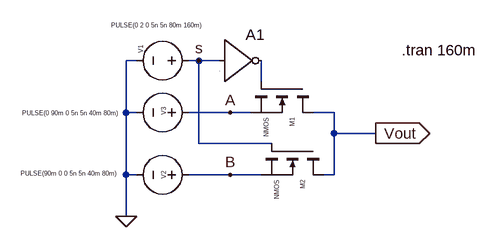
[diagram p0: schematic mux using pass transistors.asc]
mux using pass transistors.asc, the LTspice schematic file:
Version 4
SHEET 1 880 680
WIRE -48 64 -64 64
WIRE 48 64 32 64
WIRE 80 64 48 64
WIRE 144 96 144 64
WIRE -64 144 -64 64
WIRE -48 144 -64 144
WIRE 96 144 32 144
WIRE 128 144 96 144
WIRE 256 144 224 144
WIRE 256 176 256 144
WIRE 320 176 256 176
WIRE 48 192 48 64
WIRE 160 192 48 192
WIRE -64 240 -64 144
WIRE -48 240 -64 240
WIRE 96 240 32 240
WIRE 144 240 96 240
WIRE 256 240 256 176
WIRE 256 240 240 240
WIRE -64 304 -64 240
FLAG 320 176 Vout
IOPIN 320 176 Out
FLAG -64 304 0
FLAG 48 64 s
FLAG 96 144 A
FLAG 96 240 B
SYMBOL nmos 224 96 R90
WINDOW 0 56 32 Left 0
WINDOW 3 56 72 Left 0
SYMATTR InstName M1
SYMBOL nmos 240 192 R90
WINDOW 0 56 32 Left 0
WINDOW 3 56 72 Left 0
SYMATTR InstName M2
SYMBOL Digital\\inv 80 0 R0
SYMATTR InstName A1
SYMBOL voltage 48 64 R90
WINDOW 3 -55 -6 VRight 0
WINDOW 123 0 0 Left 0
WINDOW 39 0 0 Left 0
WINDOW 0 -23 89 Left 0
SYMATTR Value PULSE(0 2 0 5n 5n 80m 160m)
SYMATTR InstName V1
SYMBOL voltage 48 240 R90
WINDOW 123 0 0 Left 0
WINDOW 39 0 0 Left 0
WINDOW 0 -5 54 Left 0
WINDOW 3 -2 125 VRight 0
SYMATTR InstName V2
SYMATTR Value PULSE(90m 0 0 5n 5n 40m 80m)
SYMBOL voltage 48 144 R90
WINDOW 123 0 0 Left 0
WINDOW 39 0 0 Left 0
WINDOW 0 -8 54 Left 0
WINDOW 3 1 123 VRight 0
SYMATTR InstName V3
SYMATTR Value PULSE(0 90m 0 5n 5n 40m 80m)
TEXT 360 48 Left 2 !.tran 160m

The netlist it stands for:
* mux using pass transistors.asc
M1 Vout N001 A A NMOS
M2 Vout s B B NMOS
A1 s 0 0 0 0 N001 0 0 BUF
V1 s 0 PULSE(0 2 0 5n 5n 80m 160m)
V2 B 0 PULSE(90m 0 0 5n 5n 40m 80m)
V3 A 0 PULSE(0 90m 0 5n 5n 40m 80m)
.model NMOS NMOS
.model PMOS PMOS
.lib standard.mos
.tran 160m
.backanno
.end